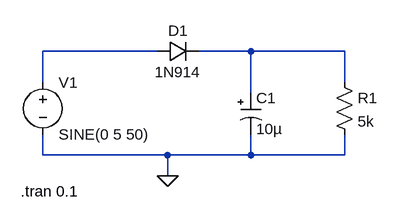
[diagram p0: schematic project.asc]
project.asc, the LTspice schematic file:
Version 4
SHEET 1 880 680
WIRE 112 -48 -64 -48
WIRE 256 -48 176 -48
WIRE 400 -48 256 -48
WIRE -64 0 -64 -48
WIRE 400 0 400 -48
WIRE 256 16 256 -48
WIRE -64 112 -64 80
WIRE 128 112 -64 112
WIRE 256 112 256 80
WIRE 256 112 128 112
WIRE 400 112 400 80
WIRE 400 112 256 112
WIRE 128 144 128 112
FLAG 128 144 0
SYMBOL diode 112 -32 R270
WINDOW 0 32 32 VTop 2
WINDOW 3 0 32 VBottom 2
SYMATTR InstName D1
SYMATTR Value 1N914
SYMBOL voltage -64 -16 R0
WINDOW 123 0 0 Left 2
WINDOW 39 0 0 Left 2
SYMATTR InstName V1
SYMATTR Value SINE(0 5 50)
SYMBOL res 384 -16 R0
SYMATTR InstName R1
SYMATTR Value 5k
SYMBOL polcap 240 16 R0
SYMATTR InstName C1
SYMATTR Value 10µ
TEXT -98 168 Left 2 !.tran 0.1

The netlist it stands for:
* project.asc
D1 N001 N002 1N914
V1 N001 0 SINE(0 5 50)
R1 N002 0 5k
C1 N002 0 10µ
.model D D
.lib standard.dio
.tran 0.1
.backanno
.end